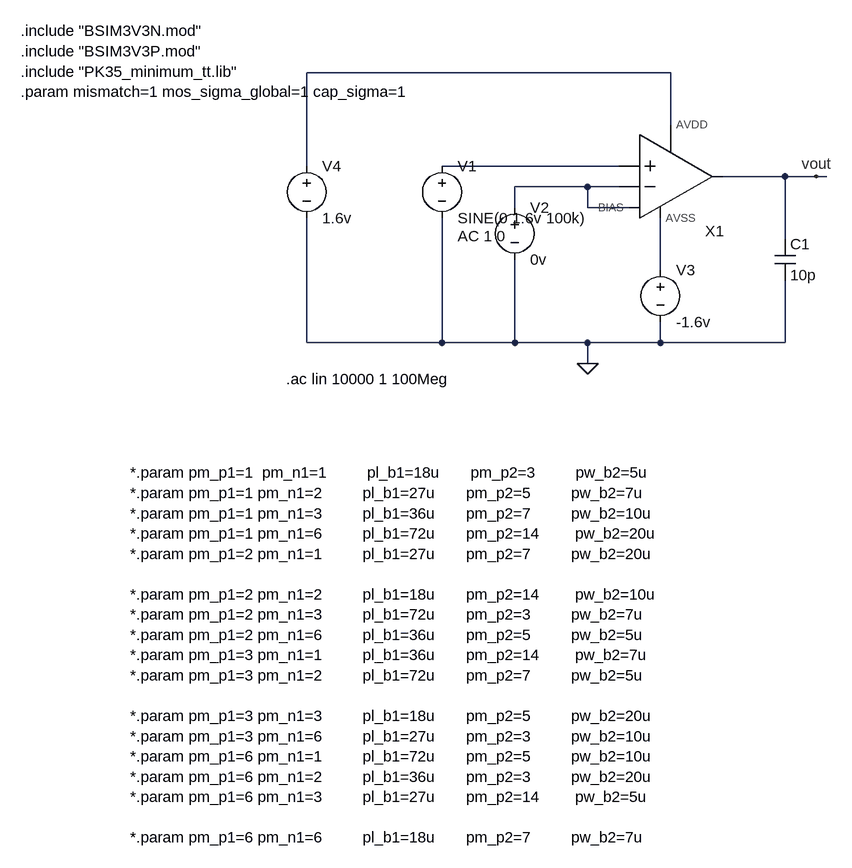
[diagram p0: schematic tb_comp_medium_ac.asc]
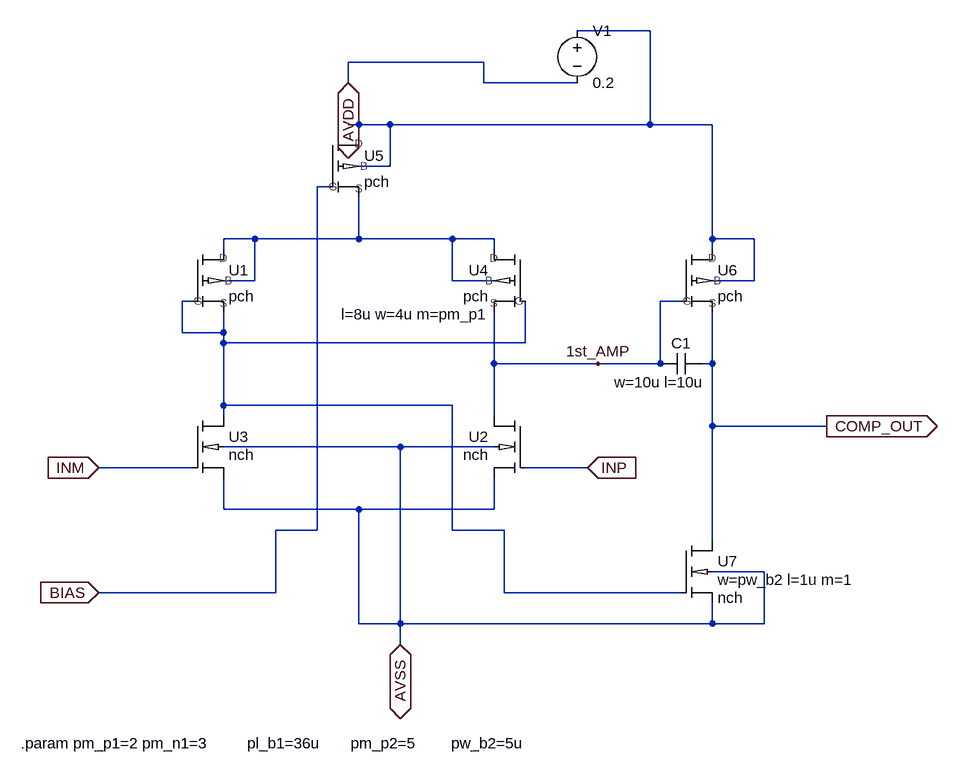
[diagram p1: sub-circuit comp_medium.asc]
tb_comp_medium_ac.asc, the LTspice schematic file:
Version 4
SHEET 1 1272 1120
WIRE 224 -16 -336 -16
WIRE 224 64 224 -16
WIRE -336 128 -336 -16
WIRE 144 128 -128 128
WIRE 400 144 304 144
WIRE 448 144 400 144
WIRE 464 144 448 144
WIRE 96 160 -16 160
WIRE 144 160 96 160
WIRE -16 192 -16 160
WIRE 96 192 96 160
WIRE 160 192 96 192
WIRE 400 240 400 144
WIRE 208 288 208 208
WIRE -336 400 -336 208
WIRE -128 400 -128 208
WIRE -128 400 -336 400
WIRE -16 400 -16 272
WIRE -16 400 -128 400
WIRE 96 400 -16 400
WIRE 208 400 208 368
WIRE 208 400 96 400
WIRE 400 400 400 304
WIRE 400 400 208 400
WIRE 96 432 96 400
FLAG 96 432 0
FLAG 448 144 vout
SYMBOL comp_medium 208 144 R0
SYMATTR InstName X1
SYMBOL voltage -128 112 R0
WINDOW 123 24 124 Left 2
WINDOW 39 0 0 Left 2
SYMATTR Value2 AC 1 0
SYMATTR InstName V1
SYMATTR Value SINE(0 1.6v 100k)
SYMBOL voltage -16 176 R0
WINDOW 123 0 0 Left 2
WINDOW 39 0 0 Left 2
SYMATTR InstName V2
SYMATTR Value 0v
SYMBOL voltage 208 272 R0
WINDOW 123 0 0 Left 2
WINDOW 39 0 0 Left 2
SYMATTR InstName V3
SYMATTR Value -1.6v
SYMBOL voltage -336 112 R0
WINDOW 123 0 0 Left 2
WINDOW 39 0 0 Left 2
SYMATTR InstName V4
SYMATTR Value 1.6v
SYMBOL cap 384 240 R0
SYMATTR InstName C1
SYMATTR Value 10p
TEXT -368 456 Left 2 !.ac lin 10000 1 100Meg
TEXT -776 -80 Left 2 !.include "BSIM3V3N.mod"\n.include "BSIM3V3P.mod"\n.include "PK35_minimum_tt.lib"\n.param mismatch=1 mos_sigma_global=1 cap_sigma=1
TEXT -608 600 Left 2 !*.param pm_p1=1  pm_n1=1         pl_b1=18u       pm_p2=3         pw_b2=5u\n*.param pm_p1=1 pm_n1=2         pl_b1=27u       pm_p2=5         pw_b2=7u\n*.param pm_p1=1 pm_n1=3         pl_b1=36u       pm_p2=7         pw_b2=10u\n*.param pm_p1=1 pm_n1=6         pl_b1=72u       pm_p2=14        pw_b2=20u\n*.param pm_p1=2 pm_n1=1         pl_b1=27u       pm_p2=7         pw_b2=20u\n \n*.param pm_p1=2 pm_n1=2         pl_b1=18u       pm_p2=14        pw_b2=10u\n*.param pm_p1=2 pm_n1=3         pl_b1=72u       pm_p2=3         pw_b2=7u\n*.param pm_p1=2 pm_n1=6         pl_b1=36u       pm_p2=5         pw_b2=5u\n*.param pm_p1=3 pm_n1=1         pl_b1=36u       pm_p2=14        pw_b2=7u\n*.param pm_p1=3 pm_n1=2         pl_b1=72u       pm_p2=7         pw_b2=5u\n \n*.param pm_p1=3 pm_n1=3         pl_b1=18u       pm_p2=5         pw_b2=20u\n*.param pm_p1=3 pm_n1=6         pl_b1=27u       pm_p2=3         pw_b2=10u\n*.param pm_p1=6 pm_n1=1         pl_b1=72u       pm_p2=5         pw_b2=10u\n*.param pm_p1=6 pm_n1=2         pl_b1=36u       pm_p2=3         pw_b2=20u\n*.param pm_p1=6 pm_n1=3         pl_b1=27u       pm_p2=14        pw_b2=5u\n \n*.param pm_p1=6 pm_n1=6         pl_b1=18u       pm_p2=7         pw_b2=7u

comp_medium.asc, the sub-circuit schematic file:
Version 4
SHEET 1 3700 4048
WIRE 624 -256 512 -256
WIRE 368 -208 160 -208
WIRE 160 -176 160 -208
WIRE 368 -176 368 -208
WIRE 512 -176 368 -176
WIRE 176 -112 160 -112
WIRE 224 -112 176 -112
WIRE 624 -112 624 -256
WIRE 624 -112 224 -112
WIRE 720 -112 624 -112
WIRE 176 -96 176 -112
WIRE 224 -48 224 -112
WIRE 224 -48 176 -48
WIRE 128 -16 112 -16
WIRE 16 64 -32 64
WIRE 176 64 176 0
WIRE 176 64 16 64
WIRE 320 64 176 64
WIRE 384 64 320 64
WIRE 720 64 720 -112
WIRE 784 64 720 64
WIRE -32 80 -32 64
WIRE 384 80 384 64
WIRE 720 80 720 64
WIRE 16 128 16 64
WIRE 16 128 -32 128
WIRE 320 128 320 64
WIRE 384 128 320 128
WIRE 784 128 784 64
WIRE 784 128 720 128
WIRE -80 160 -96 160
WIRE 672 160 640 160
WIRE -96 208 -96 160
WIRE -32 208 -32 176
WIRE -32 208 -96 208
WIRE -32 224 -32 208
WIRE 432 224 432 160
WIRE 432 224 -32 224
WIRE 384 256 384 176
WIRE 544 256 384 256
WIRE 640 256 640 160
WIRE 640 256 544 256
WIRE 720 256 720 176
WIRE 720 256 704 256
WIRE -32 320 -32 224
WIRE 320 320 -32 320
WIRE -32 336 -32 320
WIRE 384 336 384 256
WIRE 720 352 720 256
WIRE 896 352 720 352
WIRE 240 384 -32 384
WIRE 384 384 240 384
WIRE -80 416 -224 416
WIRE 528 416 432 416
WIRE -32 480 -32 432
WIRE 176 480 -32 480
WIRE 384 480 384 432
WIRE 384 480 176 480
WIRE 112 512 112 -16
WIRE 112 512 48 512
WIRE 320 512 320 320
WIRE 400 512 320 512
WIRE 720 528 720 352
WIRE 800 576 720 576
WIRE 48 608 48 512
WIRE 48 608 -224 608
WIRE 400 608 400 512
WIRE 672 608 400 608
WIRE 176 656 176 480
WIRE 240 656 240 384
WIRE 240 656 176 656
WIRE 720 656 720 624
WIRE 720 656 240 656
WIRE 800 656 800 576
WIRE 800 656 720 656
WIRE 240 688 240 656
FLAG 160 -176 AVDD
IOPIN 160 -176 BiDir
FLAG 240 688 AVSS
IOPIN 240 688 BiDir
FLAG 528 416 INP
IOPIN 528 416 In
FLAG -224 416 INM
IOPIN -224 416 In
FLAG -224 608 BIAS
IOPIN -224 608 In
FLAG 896 352 COMP_OUT
IOPIN 896 352 Out
FLAG 544 256 1st_AMP
SYMBOL MPN -48 128 R0
WINDOW 39 24 52 Left 2
SYMATTR SpiceLine ""
SYMATTR InstName U1
SYMATTR Value pch
SYMATTR Prefix M
SYMATTR Value2 l=8u w=4u m=pm_p1
SYMBOL NMD4 432 336 M0
WINDOW 3 56 60 Left 2
WINDOW 38 56 88 Left 2
SYMATTR Value nch
SYMATTR InstName U2
SYMATTR Prefix M
SYMATTR Value2 l=16u w=1u m=pm_n1
SYMBOL NMD4 -80 336 R0
WINDOW 3 56 60 Left 2
WINDOW 38 56 88 Left 2
SYMATTR Value nch
SYMATTR InstName U3
SYMATTR Prefix M
SYMATTR Value2 l=16u w=1u m=pm_n1
SYMBOL MPN 400 128 M0
WINDOW 39 24 52 Left 2
SYMATTR SpiceLine l=8u w=4u m=pm_p1
SYMATTR InstName U4
SYMATTR Value pch
SYMATTR Prefix M
SYMBOL MPN 704 128 R0
WINDOW 39 24 52 Left 2
SYMATTR SpiceLine ""
SYMATTR InstName U6
SYMATTR Value pch
SYMATTR Prefix M
SYMATTR Value2 l=1u w=4u m=pm_p2
SYMBOL NMD4 672 528 R0
WINDOW 3 56 60 Left 2
WINDOW 38 56 88 Left 2
SYMATTR Value w=pw_b2 l=1u m=1
SYMATTR SpiceModel nch
SYMATTR InstName U7
SYMATTR Prefix M
SYMBOL cap 704 240 R90
WINDOW 0 0 32 VBottom 2
WINDOW 3 32 32 VTop 2
WINDOW 39 60 66 VBottom 2
SYMATTR InstName C1
SYMATTR Value ""
SYMATTR SpiceLine w=10u l=10u
SYMATTR Prefix X
SYMATTR SpiceModel CPIP
SYMBOL MPN 160 -48 R0
WINDOW 39 24 52 Left 2
SYMATTR SpiceLine ""
SYMATTR InstName U5
SYMATTR Value pch
SYMATTR Prefix M
SYMATTR Value2 l=2u w=pl_b1 m=1
SYMBOL voltage 512 -272 R0
WINDOW 123 0 0 Left 2
WINDOW 39 0 0 Left 2
SYMATTR InstName V1
SYMATTR Value 0.2
TEXT -344 840 Left 2 !.param pm_p1=2 pm_n1=3         pl_b1=36u       pm_p2=5        pw_b2=5u

The netlist it stands for:
* tb_comp_medium_ac.asc
XX1 N003 N002 N001 N004 vout N003 comp_medium
V1 N002 0 SINE(0 1.6v 100k) AC 1 0
V2 N003 0 0v
V3 N004 0 -1.6v
V4 N001 0 1.6v
C1 vout 0 10p

* block symbol definitions
.subckt comp_medium BIAS INP AVDD AVSS COMP_OUT INM
M§U1 N002 N003 N003 N002 pch l=8u w=4u m=pm_p1
M§U2 1st_AMP INP AVSS AVSS nch l=16u w=1u m=pm_n1
M§U3 N003 INM AVSS AVSS nch l=16u w=1u m=pm_n1
M§U4 N002 N003 1st_AMP N002 pch l=8u w=4u m=pm_p1
M§U6 N001 1st_AMP COMP_OUT N001 pch l=1u w=4u m=pm_p2
M§U7 COMP_OUT N003 AVSS AVSS nch w=pw_b2 l=1u m=1
XC1 COMP_OUT 1st_AMP CPIP w=10u l=10u  ; pins A B
M§U5 N001 BIAS N002 N001 pch l=2u w=pl_b1 m=1
V1 N001 AVDD 0.2
.param pm_p1=2 pm_n1=3         pl_b1=36u       pm_p2=5        pw_b2=5u
.ends comp_medium

.model NMOS NMOS
.model PMOS PMOS
.lib standard.mos
.ac lin 10000 1 100Meg
.include "BSIM3V3N.mod"
.include "BSIM3V3P.mod"
.include "PK35_minimum_tt.lib"
.param mismatch=1 mos_sigma_global=1 cap_sigma=1
*.param pm_p1=1  pm_n1=1         pl_b1=18u       pm_p2=3         pw_b2=5u
*.param pm_p1=1 pm_n1=2         pl_b1=27u       pm_p2=5         pw_b2=7u
*.param pm_p1=1 pm_n1=3         pl_b1=36u       pm_p2=7         pw_b2=10u
*.param pm_p1=1 pm_n1=6         pl_b1=72u       pm_p2=14        pw_b2=20u
*.param pm_p1=2 pm_n1=1         pl_b1=27u       pm_p2=7         pw_b2=20u
*.param pm_p1=2 pm_n1=2         pl_b1=18u       pm_p2=14        pw_b2=10u
*.param pm_p1=2 pm_n1=3         pl_b1=72u       pm_p2=3         pw_b2=7u
*.param pm_p1=2 pm_n1=6         pl_b1=36u       pm_p2=5         pw_b2=5u
*.param pm_p1=3 pm_n1=1         pl_b1=36u       pm_p2=14        pw_b2=7u
*.param pm_p1=3 pm_n1=2         pl_b1=72u       pm_p2=7         pw_b2=5u
*.param pm_p1=3 pm_n1=3         pl_b1=18u       pm_p2=5         pw_b2=20u
*.param pm_p1=3 pm_n1=6         pl_b1=27u       pm_p2=3         pw_b2=10u
*.param pm_p1=6 pm_n1=1         pl_b1=72u       pm_p2=5         pw_b2=10u
*.param pm_p1=6 pm_n1=2         pl_b1=36u       pm_p2=3         pw_b2=20u
*.param pm_p1=6 pm_n1=3         pl_b1=27u       pm_p2=14        pw_b2=5u
*.param pm_p1=6 pm_n1=6         pl_b1=18u       pm_p2=7         pw_b2=7u
.backanno
.end